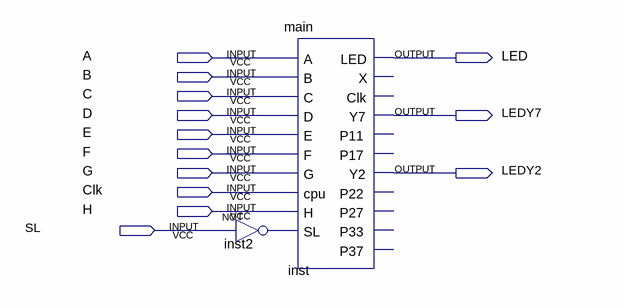
[diagram p0: schematic sheet]
// Quartus schematic Sequence_Detector.bdf as structural Verilog: 2 symbols, 13 pins
module Sequence_Detector (
  input  A,
  input  B,
  input  C,
  input  D,
  input  E,
  input  F,
  input  G,
  input  Clk,
  input  H,
  input  SL,
  output LED,
  output LEDY7,
  output LEDY2
);

  wire inst2_out;

  not inst2 (inst2_out, SL);
  main inst (
    .A(A), .B(B), .C(C), .D(D), .E(E), .F(F), .G(G), .cpu(Clk), .H(H), .SL(inst2_out), .LED(LED), .Y7(LEDY7),
    .Y2(LEDY2));  // open: X, Clk, P11, P17, P22, P27, P33, P37
endmodule
